# EAGLE design MySensorMicro (EAGLE 7.5.0)
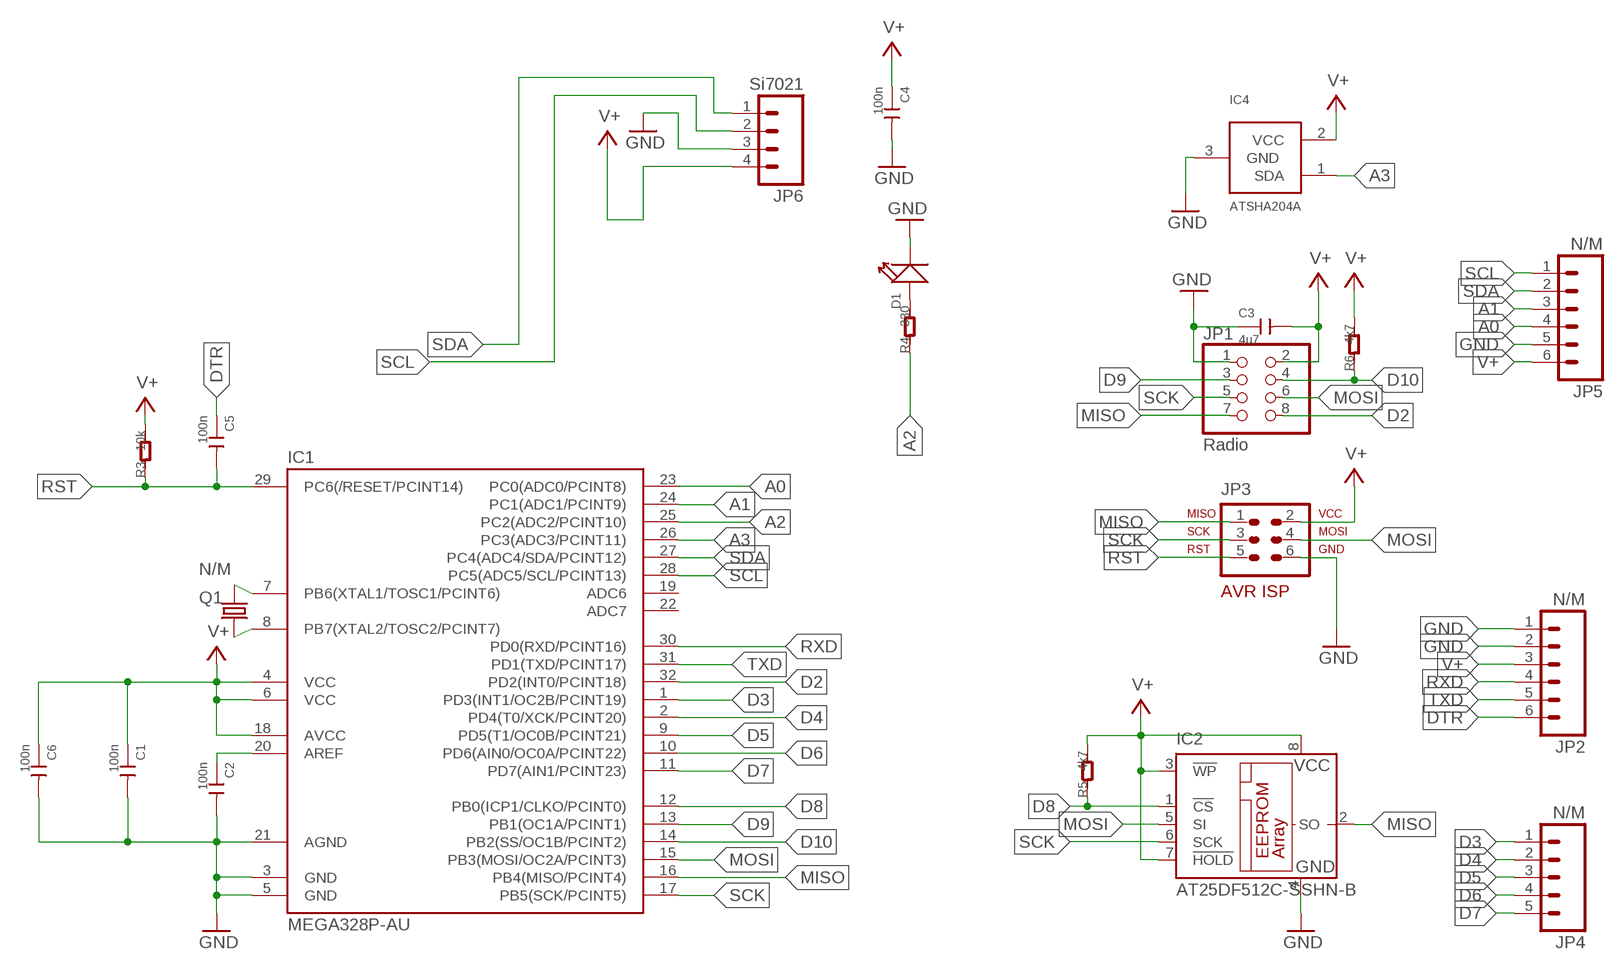
[diagram p0: schematic, sheet 1]

## Parts
C1  100n  CAP-0402  [C0402]
C2  100n  CAP-0402  [C0402]
C3  4u7  CAP-0603  [C0603]
C4  100n  CAP-0402  [C0402]
C5  100n  CAP-0402  [C0402]
C6  100n  CAP-0402  [C0402]
D1  LED-0402  [LED-0402]
IC1  MEGA328P-AU  MEGA48/88/168-AU  [TQFP32-08]
IC2  AT25DF512C-SSHN-B  25AA080SN  [SO-08]
IC4  ATSHA204A  [SOT23]
JP1  Radio  PINHD-2X4  [2X04]
JP2  N/M  M06NO_SILK_FEMALE_PTH  [1X06_NO_SILK]
JP3  N/M  AVR-ISP-6VERT  [AVR-ISP-6]
JP4  N/M  M05NO_SILK  [1X05_NO_SILK]
JP5  N/M  M06NO_SILK_FEMALE_PTH  [1X06_NO_SILK]
JP6  Si7021  M04PTH  [1X04]
Q1  N/M  CRYSTAL-306010055  [2P-L3.2XW1.5MM]
R3  10k  R-0402  [R0402]
R4  330  R-0402  [R0402]
R5  4k7  R-0402  [R0402]
R6  4k7  R-0402  [R0402]

## Nets
A0: IC1.23(PC0(ADC0/PCINT8)) JP5.4
A1: IC1.24(PC1(ADC1/PCINT9)) JP5.3
A2: IC1.25(PC2(ADC2/PCINT10)) R4.1
A3: IC1.26(PC3(ADC3/PCINT11)) IC4.1(SDA)
D2: IC1.32(PD2(INT0/PCINT18)) JP1.8
D3: IC1.1(PD3(INT1/OC2B/PCINT19)) JP4.1
D4: IC1.2(PD4(T0/XCK/PCINT20)) JP4.2
D5: IC1.9(PD5(T1/OC0B/PCINT21)) JP4.3
D6: IC1.10(PD6(AIN0/OC0A/PCINT22)) JP4.4
D7: IC1.11(PD7(AIN1/PCINT23)) JP4.5
D8: IC1.12(PB0(ICP1/CLKO/PCINT0)) IC2.1(!CS) R5.1
D9: IC1.13(PB1(OC1A/PCINT1)) JP1.3
D10: IC1.14(PB2(SS/OC1B/PCINT2)) JP1.4 R6.1
DTR: C5.1 JP2.6
GND [Power]: C1.2 C2.2 C3.1 C4.2 C6.2 D1.- IC1.3(GND) IC1.5(GND) IC1.21(AGND) IC2.4(GND) IC4.3(GND) JP1.1 JP2.1 JP2.2 JP3.6 JP5.5 JP6.3
MISO: IC1.16(PB4(MISO/PCINT4)) IC2.2(SO) JP1.7 JP3.1
MOSI: IC1.15(PB3(MOSI/OC2A/PCINT3)) IC2.5(SI) JP1.6 JP3.4
N$1: IC1.7(PB6(XTAL1/TOSC1/PCINT6)) Q1.1
N$2: IC1.8(PB7(XTAL2/TOSC2/PCINT7)) Q1.2
N$3: D1.+ R4.2
N$4: C2.1 IC1.20(AREF)
RST: C5.2 IC1.29(PC6(/RESET/PCINT14)) JP3.5 R3.1
RXD: IC1.30(PD0(RXD/PCINT16)) JP2.4
SCK: IC1.17(PB5(SCK/PCINT5)) IC2.6(SCK) JP1.5 JP3.3
SCL: IC1.28(PC5(ADC5/SCL/PCINT13)) JP5.1 JP6.2
SDA: IC1.27(PC4(ADC4/SDA/PCINT12)) JP5.2 JP6.1
TXD: IC1.31(PD1(TXD/PCINT17)) JP2.5
V+ [Power]: C1.1 C3.2 C4.1 C6.1 IC1.4(VCC) IC1.6(VCC) IC1.18(AVCC) IC2.3(!WP) IC2.7(!HOLD) IC2.8(VCC) IC4.2(VCC) JP1.2 JP2.3 JP3.2 JP5.6 JP6.4 R3.2 R5.2 R6.2
Unconnected: IC1.19(ADC6) IC1.22(ADC7)

## Library data of the parts
C1-C6 = Discrete:CAP: Ceramic Capacitors
D1 = Discrete:LED
IC1 = avr-7:MEGA48/88/168
IC2 = microchip:25*: Serial EEPROM 4K/ 8K , SPI bus; MF: MICROCHIP; MPN: 25AA080/SN; OC_FARNELL: 1816072; OC_NEWARK: 92C7351
IC4 = Sensor:ATSHA204A
JP1 = pinhead:PINHD-2X4: PIN HEADER
JP2 JP5 = SparkFun-Connectors:M06: Header 6 Standard 6-pin 0.1" header. Use with straight break away headers (SKU : PRT-00116), right angle break away headers (PRT-00553), swiss pins (PRT-00743), machine pins (PRT-00117), and female headers (PRT-00115). Molex polarized connector foot print use with SKU : PRT-08094 with associated crimp pins and housings. NOTES ON THE VARIANTS LOCK and LOCK_LONGPADS... This footprint was designed to help hold the alignment of a through-hole component (i.e. 6-pin header) while soldering it into place. You may notice that each hole has been shifted either up or down by 0.005 of an inch from it's more standard position (which is a perfectly straight line). This slight alteration caused the pins (the squares in the middle) to touch the edges of the holes. Because they are alternating, it causes a "brace" to hold the component in place. 0.005 has proven to be the perfect amount of "off-center" position when using our standard breakaway headers. Although looks a little odd when you look at the bare footprint, once you have a header in there, the alteration is very hard to notice. Also,if you push a header all the way into place, it is covered up entirely on the bottom side. This idea of altering the position of holes to aid alignment will be further integrated into the Sparkfun Library for other footprints. It can help hold any component with 3 or more connection pins.; PROD_ID: CONN-08437
JP3 = avr-7:AVR-ISP-6: AVR ISP-6 Serial Programming Header
JP4 = SparkFun-Connectors:M05: Header 5 Standard 5-pin 0.1" header. Use with straight break away headers (SKU : PRT-00116), right angle break away headers (PRT-00553), swiss pins (PRT-00743), machine pins (PRT-00117), and female headers (PRT-00115). Molex polarized connector foot print use with SKU : PRT-08230 with associated crimp pins and housings.
JP6 = SparkFun-Connectors:M04: Header 4 Standard 4-pin 0.1" header. Use with straight break away headers (SKU : PRT-00116), right angle break away headers (PRT-00553), swiss pins (PRT-00743), machine pins (PRT-00117), and female headers (PRT-00115). Molex polarized connector foot print use with SKU : PRT-08231 with associated crimp pins and housings. 1MM SMD Version SKU: PRT-10208; PROD_ID: CONN-09696
Q1 = Discrete:CRYSTAL*
R3-R6 = Discrete:R*

## Net classes
0 default: width 0.203 mm
1 Power: width 0.406 mm

## Board
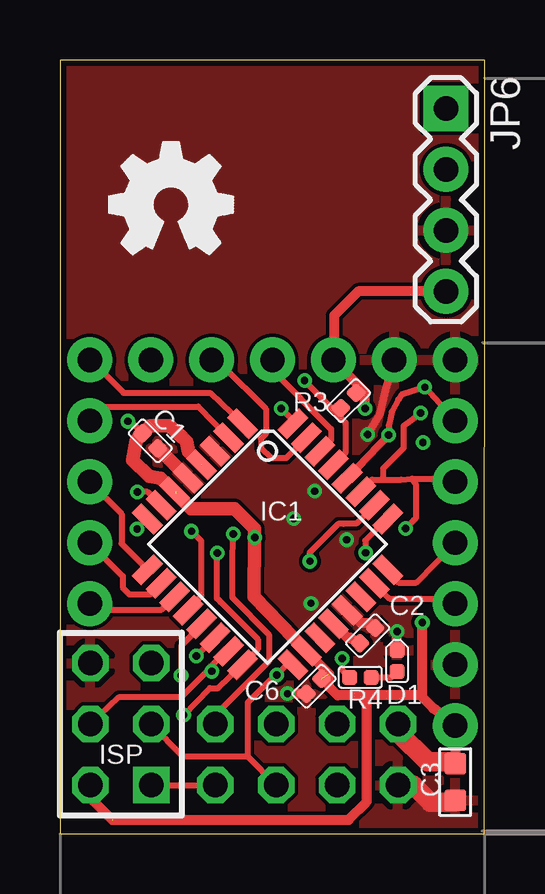
[diagram p1: board, top side]
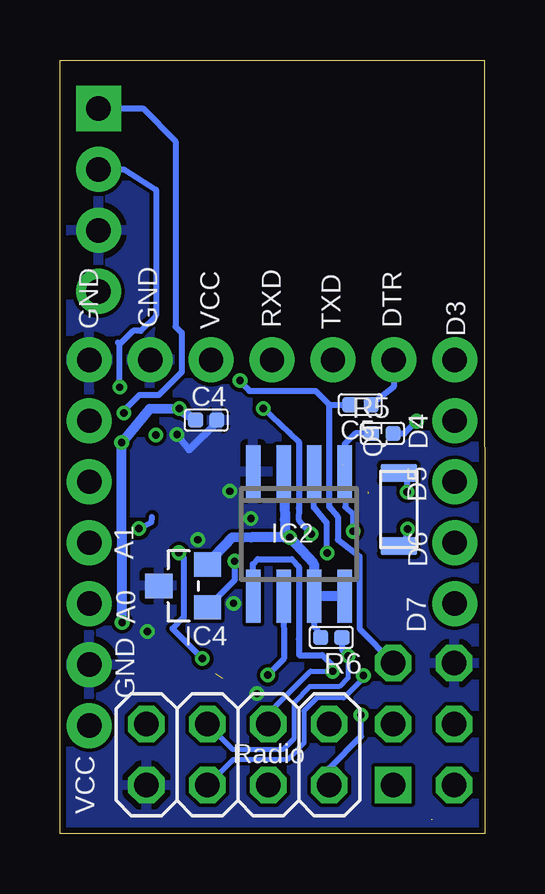
[diagram p2: board, bottom side, seen from below]

Size 17.71 x 32.24 mm. Coordinates in mm from the lower left corner, seen from the top.
Outline: 0,0 17.7,0 17.71,32.24 0.01,32.24 0,0
Copper layers (1*16): Top 0.035mm / dielectric 1.5mm / Bottom 0.035mm
Design rules "ITEADstudio_DRC": minimum track width 6mil, minimum drill 12mil, track to track 6mil, track to pad 6mil, pad to pad 6mil, via to via 6mil, smd to smd 0mil, copper to edge 10mil, drill to drill 10mil, minimum pad ring 10mil, minimum via ring 6mil, stop-mask expansion 2mil, vias tented up to drill 100mil, thermal gap 10mil

### Footprints (pad centres in the part's own frame; a part is rotated, then mirrored left to right if it is on the bottom)
C0402 = smd 0.635 x 0.635: 1 -0.445,0; 2 0.445,0
C0603 = smd 0.889 x 0.889: 1 -0.762,0; 2 0.762,0
LED-0402 = smd 0.635 x 0.635: + -0.445,0; - 0.445,0
TQFP32-08 = smd 1.27 x 0.559: 1 -4.293,2.8; 2 -4.293,2; 3 -4.293,1.2; 4 -4.293,0.4; 5 -4.293,-0.4; 6 -4.293,-1.2; 7 -4.293,-2; 8 -4.293,-2.8; 17 4.293,-2.8; 18 4.293,-2; 19 4.293,-1.2; 20 4.293,-0.4; 21 4.293,0.4; 22 4.293,1.2; 23 4.293,2; 24 4.293,2.8 | smd 0.559 x 1.27: 9 -2.8,-4.293; 10 -2,-4.293; 11 -1.2,-4.293; 12 -0.4,-4.293; 13 0.4,-4.293; 14 1.2,-4.293; 15 2,-4.293; 16 2.8,-4.293; 25 2.8,4.293; 26 2,4.293; 27 1.2,4.293; 28 0.4,4.293; 29 -0.4,4.293; 30 -1.2,4.293; 31 -2,4.293; 32 -2.8,4.293
SO-08 = smd 0.6 x 2.2: 1 -1.905,-2.6; 2 -0.635,-2.6; 3 0.635,-2.6; 4 1.905,-2.6; 5 1.905,2.6; 6 0.635,2.6; 7 -0.635,2.6; 8 -1.905,2.6
SOT23 = smd 1.016 x 1.143: 1 -0.889,-1.016; 2 0.889,-1.016; 3 0,1.016
2X04 = drill 1.016 octagon: 1 -3.81,-1.27; 2 -3.81,1.27; 3 -1.27,-1.27; 4 -1.27,1.27; 5 1.27,-1.27; 6 1.27,1.27; 7 3.81,-1.27; 8 3.81,1.27
1X06_NO_SILK = drill 1.016 pad 1.88: 1 0,0; 2 2.54,0; 3 5.08,0; 4 7.62,0; 5 10.16,0; 6 12.7,0
AVR-ISP-6 = drill 1.016 square: 1 -2.54,-1.27 | drill 1.016 octagon: 2 -2.54,1.27; 3 0,-1.27; 4 0,1.27; 5 2.54,-1.27; 6 2.54,1.27
1X05_NO_SILK = drill 1.016 pad 1.88: 1 0,0; 2 2.54,0; 3 5.08,0; 4 7.62,0; 5 10.16,0
1X04 = drill 1.016 pad 1.88 square: 1 0,0 | drill 1.016 pad 1.88: 2 2.54,0; 3 5.08,0; 4 7.62,0
2P-L3.2XW1.5MM = smd 0.762 x 1.524: 1 -1.524,0; 2 1.524,0
R0402 = smd 0.635 x 0.635: 1 0,0.445; 2 0,-0.445

### Placement (x,y rotation side)
C1  3.76,16.38 315 top
C2  12.83,8.26 45 top
C3  16.48,2.16 90 top
C4  11.61,17.24 0 bottom
C5  5.18,17.88 180 bottom
C6  10.6,6.15 225 top
D1  14.06,7.21 90 top
IC1  8.66,12.06 315 top
IC2  7.74,12.5 180 bottom
IC4  12.57,10.33 90 bottom
JP1  10.29,3.3 0 bottom
JP2  16.48,19.75 180 top
JP3  2.54,4.57 90 top
JP4  1.24,19.75 270 top
JP5  16.48,17.21 270 top
JP6  16.1,30.23 270 top
Q1  3.58,13.51 270 bottom
R3  12.03,18.06 135 top
R4  12.53,6.52 90 top
R5  4.26,16.69 90 bottom
R6  6.39,8.19 270 bottom

### Tracks (layer width: path | path; a pad name or v marks a point on that pad's centre or on a via)
A0
  Top 0.254: IC1.23 13.74,9.8 15.93,9.8 JP5.4
A1
  Top 0.254: IC1.24 13.96,10.68 14.12,10.46 14.86,10.46 JP5.3
A2  (via drill 0.3)
  Top 0.254: v11.77,7.3 11.77,6.84 R4.1 | IC1.25 13.64,13.12 12.73,12.22 12.75,12.19 v12.75,11.71
  Bottom 0.254: v11.77,7.3 13.01,8.55 12.54,9.02 12.54,11.5 12.63,11.62 v12.75,11.71
A3  (via drill 0.3)
  Top 0.254: IC1.26 12.36,12.92 11.83,12.92 11.61,12.92 10.42,11.73 v10.42,11.36
  Bottom 0.254: v10.42,11.36 10.42,10.57 IC4.1
D2  (via drill 0.3)
  Top 0.254: JP1.8 6.5,4.57 6.5,4.98 8.72,7.19 8.71,8.3 7.19,9.84 7.19,11.19 v7.23,12.49 | IC1.32 9.78,17.16 v9.22,17.72
  Bottom 0.254: v7.23,12.49 7.7,13 7.76,13.09 7.75,13.57 7.74,16.34 8.12,16.69 8.14,16.72 v9.22,17.72
D3
  Top 0.254: JP4.1 1.47,19.57 2.65,18.38 6.26,18.38 IC1.1
D4
  Top 0.254: JP4.2 1.35,17.22 0.91,17.8 5.78,17.8 IC1.2
D5
  Top 0.254: JP4.3 1.22,14.68 2.56,13.34 2.56,12.09 IC1.9
D6
  Top 0.254: JP4.4 1.22,12.14 2.62,10.74 2.62,10.26 2.9,9.98 3.75,9.98 IC1.10
D7
  Top 0.254: JP4.5 1.47,9.35 4.25,9.35 IC1.11
D8  (via drill 0.3)
  Top 0.254: IC1.12 5.34,9.36 5.9,9.93 5.9,12.2 v5.49,12.61
  Bottom 0.254: v5.49,12.61 5.49,13.31 5.81,13.62 5.81,15.1 IC2.1 5.83,16.25 5.4,16.69 R5.1
D9  (via drill 0.3)
  Top 0.254: IC1.13 5.91,8.7 5.05,7.85 v5.05,6.6
  Bottom 0.203: 5.11,6.43 5.87,5.66 6.99,5.66 7.54,5.12 7.54,3.79 8.23,3.1 10.48,3.1 JP1.3
  Bottom 0.254: v5.05,6.6 5.11,6.43
D10  (via drill 0.3)
  Top 0.254: IC1.14 6.45,8.18 v5.69,7.42
  Bottom 0.203: v5.69,7.42 5.69,6.5 6.05,6.13 7.3,6.13 7.95,5.47 7.95,3.96 8.41,3.52 10.49,3.51 JP1.4
  Bottom 0.254: R6.1 5.95,7.67 v5.69,7.42
DTR
  Bottom 0.254: JP2.6 3.79,18.63 C5.1
GND  (via drill 0.3)
  Top 0.305: v12.83,16.64 13.34,17.48 13.59,18.54 JP2.2
  Top 0.406: IC1.21 12.55,8.79 12.94,8.79 C2.2 | 16.47,1.32 C3.1 | C6.2 9.53,5.84 v9.49,5.84 | D1.- 14.06,8.42
  Top 0.559: C1.2 4.37,15.8 IC1.5
  Top 0.813: JP1.1 14.73,2.03 15.44,1.32 16.47,1.32
  Bottom 0.305: C4.2 11.16,17.16 12.32,16 v12.83,16.64
  other vias: 9.74,13.15 10.62,14.28 10.47,9.61 14.07,8.43 11.96,12.25
  pour Top: 14.35,11.94 8.71,17.75 3.76,12.8 3.05,12.22 8.53,6.32
  pour Bottom: -0.04,32.19 17.69,32.19 17.66,0 -0.07,0
  pour Top: -0.13,32.13 17.65,32.13 17.65,0 -0.13,0
MISO  (via drill 0.3)
  Top 0.254: JP3.1 JP1.7 | v5.16,4.95 6.25,6.07 6.6,6.07 IC1.16 8.26,7.7 8.26,8.1 6.7,9.66 6.54,9.81 6.54,11.52 v6.56,11.7
  Bottom 0.254: JP1.7 6.48,2.74 5.16,4.06 v5.16,4.95 | IC2.2 7.13,13.62 7.12,13.6 6.59,12.97 6.59,12.1 6.59,11.67 v6.56,11.7
MOSI  (via drill 0.3)
  Top 0.254: JP3.4 2.44,5.69 5.05,5.69 6.12,6.76 v6.33,6.78 6.3,6.99 6.93,7.62 IC1.15
  Bottom 0.203: JP1.6 9.02,5.02 7.26,6.78 v6.33,6.78 | v6.33,6.78
  Bottom 0.254: IC2.5 9.66,11.24 9.46,11.45 8.04,11.45 7.74,11.13 7.74,8.13 7.74,7.44 6.76,7.44 6.3,6.99 v6.33,6.78 6.43,6.69
N$1  (via drill 0.3)
  Top 0.254: IC1.7 3.65,14.25 v3.23,14.25
  Bottom 0.254: v3.23,14.25 3.23,14.79 Q1.1
N$2  (via drill 0.3)
  Top 0.254: IC1.8 3.6,13.12 v3.22,12.71
  Bottom 0.254: v3.22,12.71 3.26,12.66 3.28,12.64 3.28,12.11 Q1.2
N$3
  Top 0.254: R4.2 13.82,6.52 D1.+
N$4
  Top 0.406: IC1.20 11.99,8.18 12.11,8.18 C2.1
RST  (via drill 0.3)
  Top 0.254: v10.2,18.89 11.61,17.45 11.91,17.14 11.91,15.88 IC1.29
  Top 0.305: R3.1 11.61,17.45
  Bottom 0.254: JP3.5 5.2,8.52 5.2,11.56 6.12,12.26 6.12,13.21 6.48,13.63 6.47,16.79 6.47,17.88 | v10.2,18.89 10.19,18.83 9.81,18.46 7.05,18.46 6.47,17.88 | 6.47,17.88 C5.2
RXD
  Top 0.254: JP2.4 8.84,19.33 11.3,16.87 11.3,16.4 IC1.30
SCK  (via drill 0.3)
  Top 0.254: JP3.3 5.11,3.23 7.82,3.23 | 7.82,3.23 JP1.5 | IC1.17 9.48,7.05 v9.04,6.61 8.97,6.61 7.82,5.47 7.82,3.23
  Bottom 0.254: IC2.6 8.37,7.29 8.87,6.79 v9.04,6.61
SCL  (via drill 0.3)
  Top 0.254: JP5.1 v15.22,18.61 14.25,18.29 14.11,18.09 13.84,17.58 13.71,17.02 v13.71,16.62 | IC1.28 12.07,14.82 12.04,14.87
  Top 0.305: v13.71,16.62 IC1.28
  Bottom 0.254: JP6.2 15.04,27.69 13.71,26.85 13.71,21.59 14.34,20.96 14.65,20.96 15.22,20.4 | v15.22,18.61 15.22,20.4 | 15.22,20.4 15.3,20.48
SDA  (via drill 0.3)
  Top 0.254: IC1.27 12.19,13.92 13.03,14.76 13.49,14.76 | 13.49,14.76 14.24,14.76 14.69,14.8 | 14.69,14.8 16.14,14.8 JP5.2 | 14.69,14.8 14.83,14.57 14.83,13.15 14.76,13.08 v14.41,12.72 | 13.49,14.76 13.49,15.23 14.34,16.08 14.34,17 v15.04,17.53
  Bottom 0.254: v14.41,12.72 13.89,12.99 13.87,13.21 | JP6.1 14.25,30.23 12.89,28.87 12.89,21.14 12.63,20.88 12.63,19.24 13.57,18.3 14.39,18.3 15.04,17.65 v15.04,17.53
TXD
  Top 0.254: JP2.5 6.78,19.51 8.59,17.7 8.59,16.67 8.38,16.46 8.38,16.08 8.8,15.67 9.44,15.67 IC1.31
V+  (via drill 0.3)  (4 unrouted)
  Top 0.254: v2.84,17.19 2.95,17.19 C1.1
  Top 0.305: 12.72,18.42 R3.2
  Top 0.406: IC1.6 4.85,14.25 | JP3.2 1.27,1.5 2.18,0.58 | 10.28,7.6 IC1.18 11.23,6.67 11.23,6.12 11.58,5.77 12.8,5.77 | 15.01,5.77 15.04,5.77 15.57,5.23 JP5.6 C3.2 16.47,3 | 15.01,5.77 12.8,5.77 | 15.01,5.77 15.11,5.82 v15.11,8.81 | JP2.3 11.44,19.5 | 15.11,16.29 v15.14,16.31 | v12.72,17.72 12.72,18.42 JP2.3 | 2.21,0.58 12.04,0.58 12.8,1.35 12.8,5.77 | JP6.4 12.45,22.61 11.43,21.59 11.43,19.78 JP2.3
  Top 0.559: IC1.18 8.1,9.87 v8.12,12.34 8.12,12.72 7.28,13.55 5.48,13.55 4.85,14.18 | IC1.4 5.37,15.92 5.28,16.34 5.11,16.5 4.57,17 3.75,17 C1.1 3.17,16.37 3.04,15.57 3.71,14.89 4.2,14.81 IC1.6
  Top 0.813: JP1.2 14.1,4.24 15.34,3 16.47,3
  Bottom 0.254: R6.2 6.84,8.35 7.1,8.61 IC2.7 | R5.2 3.34,16.69 v2.84,17.19
  Bottom 0.406: IC2.8 IC2.7 7.12,11.25 v8.12,12.34 8.36,12.35 | IC2.3 8.33,13.1 8.33,12.55 8.36,12.35 | v15.11,8.81 v15.14,16.31 | 15.11,16.33 v15.14,16.31 | C4.1 12.7,17.67 12.66,17.72 12.69,17.68 | 12.69,17.68 13.97,17.7 v15.14,16.31 | 12.69,17.68 12.7,17.72 v12.72,17.72 | 8.36,12.35 9.72,12.35 10.07,12.34 10.52,12.35 11.27,11.54 11.51,11.21 IC4.2

### Text on the board
bPlace: D3 | D4 | D5 | D6 | A1 | D7 | A0 | GND | VCC
tNames: ISP
bNames: DTR | TXD | RXD | VCC | GND | GND | Radio